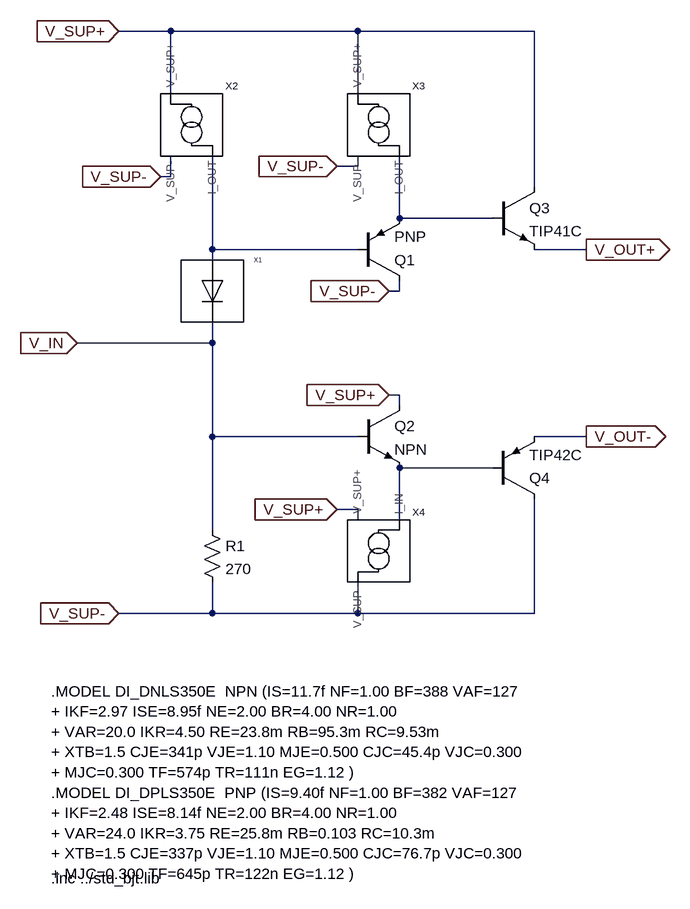
[diagram p0: schematic bias.asc]
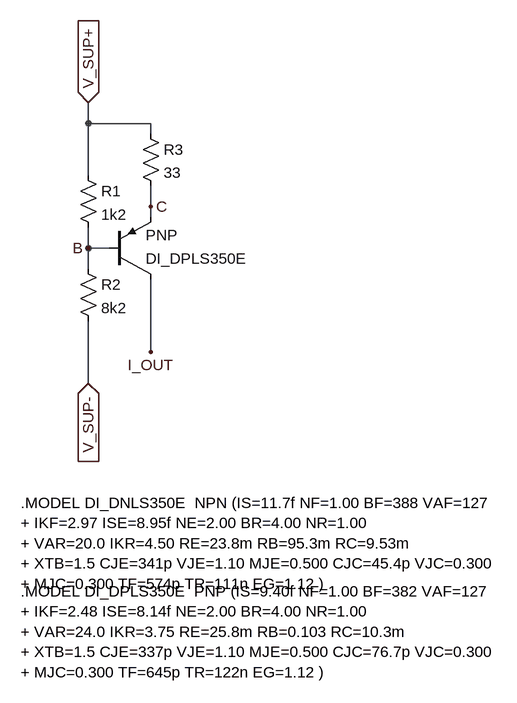
[diagram p1: sub-circuit current_source_highside.asc]
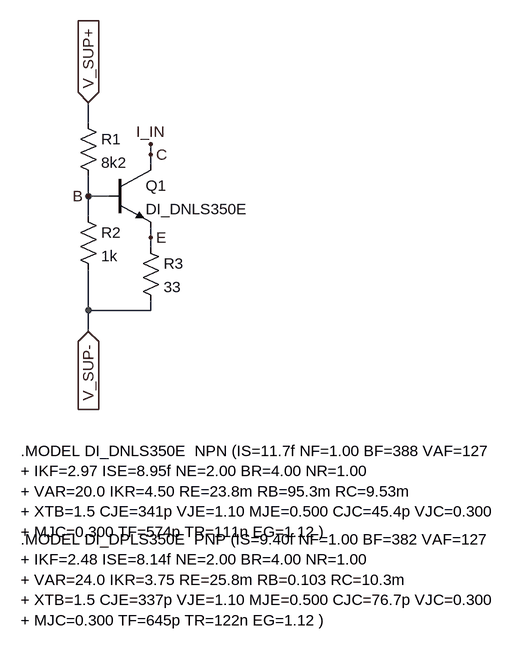
[diagram p2: sub-circuit current_source_lowside.asc]
bias.asc, the LTspice schematic file:
Version 4
SHEET 1 892 1104
WIRE 96 -384 16 -384
WIRE 384 -384 96 -384
WIRE 656 -384 384 -384
WIRE 96 -288 96 -384
WIRE 384 -288 384 -384
WIRE 384 -176 384 -192
WIRE 384 -176 352 -176
WIRE 96 -160 96 -192
WIRE 96 -160 80 -160
WIRE 656 -144 656 -384
WIRE 448 -96 448 -192
WIRE 592 -96 448 -96
WIRE 160 -48 160 -192
WIRE 384 -48 160 -48
WIRE 736 -48 656 -48
WIRE 160 -32 160 -48
WIRE 448 16 448 0
WIRE 448 16 432 16
WIRE 160 96 160 64
WIRE 160 96 -48 96
WIRE 448 176 432 176
WIRE 448 192 448 176
WIRE 160 240 160 96
WIRE 384 240 160 240
WIRE 736 240 656 240
WIRE 592 288 448 288
WIRE 384 352 352 352
WIRE 384 368 384 352
WIRE 448 368 448 288
WIRE 160 384 160 240
WIRE 160 512 160 464
WIRE 160 512 16 512
WIRE 384 512 384 464
WIRE 384 512 160 512
WIRE 656 512 656 336
WIRE 656 512 384 512
FLAG 16 512 V_SUP-
IOPIN 16 512 In
FLAG 16 -384 V_SUP+
IOPIN 16 -384 In
FLAG 80 -160 V_SUP-
IOPIN 80 -160 In
FLAG 736 -48 V_OUT+
IOPIN 736 -48 Out
FLAG 736 240 V_OUT-
IOPIN 736 240 Out
FLAG -48 96 V_IN
IOPIN -48 96 In
FLAG 352 -176 V_SUP-
IOPIN 352 -176 In
FLAG 432 16 V_SUP-
IOPIN 432 16 In
FLAG 432 176 V_SUP+
IOPIN 432 176 In
FLAG 352 352 V_SUP+
IOPIN 352 352 In
SYMBOL rubber_diode 160 16 R0
SYMATTR InstName X1
SYMBOL current_source_highside 128 -240 R0
SYMATTR InstName X2
SYMBOL res 144 368 R0
SYMATTR InstName R1
SYMATTR Value 270
SYMBOL npn 592 -144 R0
SYMATTR InstName Q3
SYMATTR Value TIP41C
SYMBOL pnp 592 336 M180
SYMATTR InstName Q4
SYMATTR Value TIP42C
SYMBOL current_source_highside 416 -240 R0
SYMATTR InstName X3
SYMBOL current_source_lowside 416 416 R0
SYMATTR InstName X4
SYMBOL npn 384 192 R0
SYMATTR InstName Q2
SYMBOL pnp 384 0 M180
SYMATTR InstName Q1
TEXT -88 632 Left 2 !.MODEL DI_DNLS350E  NPN (IS=11.7f NF=1.00 BF=388 VAF=127\n+ IKF=2.97 ISE=8.95f NE=2.00 BR=4.00 NR=1.00\n+ VAR=20.0 IKR=4.50 RE=23.8m RB=95.3m RC=9.53m\n+ XTB=1.5 CJE=341p VJE=1.10 MJE=0.500 CJC=45.4p VJC=0.300\n+ MJC=0.300 TF=574p TR=111n EG=1.12 )\n.MODEL DI_DPLS350E  PNP (IS=9.40f NF=1.00 BF=382 VAF=127\n+ IKF=2.48 ISE=8.14f NE=2.00 BR=4.00 NR=1.00\n+ VAR=24.0 IKR=3.75 RE=25.8m RB=0.103 RC=10.3m\n+ XTB=1.5 CJE=337p VJE=1.10 MJE=0.500 CJC=76.7p VJC=0.300\n+ MJC=0.300 TF=645p TR=122n EG=1.12 )
TEXT -88 920 Left 2 !.inc ../std_bjt.lib

current_source_highside.asc, the sub-circuit schematic file:
Version 4
SHEET 1 912 680
WIRE 240 -400 240 -432
WIRE 336 -400 240 -400
WIRE 336 -384 336 -400
WIRE 240 -320 240 -400
WIRE 336 -272 336 -304
WIRE 336 -256 336 -272
WIRE 240 -208 240 -240
WIRE 272 -208 240 -208
WIRE 240 -176 240 -208
WIRE 336 -48 336 -160
WIRE 240 0 240 -96
FLAG 240 0 V_SUP-
IOPIN 240 0 In
FLAG 240 -432 V_SUP+
IOPIN 240 -432 In
FLAG 336 -48 I_OUT
FLAG 240 -208 B
FLAG 336 -272 C
SYMBOL res 224 -336 R0
SYMATTR InstName R1
SYMATTR Value 1k2
SYMBOL res 224 -192 R0
SYMATTR InstName R2
SYMATTR Value 8k2
SYMBOL res 320 -400 R0
SYMATTR InstName R3
SYMATTR Value 33
SYMBOL pnp 272 -160 M180
SYMATTR InstName DI_DPLS350E
TEXT 136 184 Left 2 !.MODEL DI_DNLS350E  NPN (IS=11.7f NF=1.00 BF=388 VAF=127\n+ IKF=2.97 ISE=8.95f NE=2.00 BR=4.00 NR=1.00\n+ VAR=20.0 IKR=4.50 RE=23.8m RB=95.3m RC=9.53m\n+ XTB=1.5 CJE=341p VJE=1.10 MJE=0.500 CJC=45.4p VJC=0.300\n+ MJC=0.300 TF=574p TR=111n EG=1.12 )
TEXT 136 320 Left 2 !.MODEL DI_DPLS350E  PNP (IS=9.40f NF=1.00 BF=382 VAF=127\n+ IKF=2.48 ISE=8.14f NE=2.00 BR=4.00 NR=1.00\n+ VAR=24.0 IKR=3.75 RE=25.8m RB=0.103 RC=10.3m\n+ XTB=1.5 CJE=337p VJE=1.10 MJE=0.500 CJC=76.7p VJC=0.300\n+ MJC=0.300 TF=645p TR=122n EG=1.12 )

current_source_lowside.asc, the sub-circuit schematic file:
Version 4
SHEET 1 912 680
WIRE 240 -320 240 -352
WIRE 336 -272 336 -288
WIRE 336 -256 336 -272
WIRE 240 -208 240 -240
WIRE 272 -208 240 -208
WIRE 240 -176 240 -208
WIRE 336 -144 336 -160
WIRE 336 -128 336 -144
WIRE 240 -32 240 -96
WIRE 336 -32 336 -48
WIRE 336 -32 240 -32
WIRE 240 0 240 -32
FLAG 240 0 V_SUP-
IOPIN 240 0 In
FLAG 240 -352 V_SUP+
IOPIN 240 -352 In
FLAG 336 -288 I_IN
FLAG 240 -208 B
FLAG 336 -144 E
FLAG 336 -272 C
SYMBOL npn 272 -256 R0
SYMATTR InstName Q1
SYMATTR Value DI_DNLS350E
SYMBOL res 224 -336 R0
SYMATTR InstName R1
SYMATTR Value 8k2
SYMBOL res 224 -192 R0
SYMATTR InstName R2
SYMATTR Value 1k
SYMBOL res 320 -144 R0
SYMATTR InstName R3
SYMATTR Value 33
TEXT 136 184 Left 2 !.MODEL DI_DNLS350E  NPN (IS=11.7f NF=1.00 BF=388 VAF=127\n+ IKF=2.97 ISE=8.95f NE=2.00 BR=4.00 NR=1.00\n+ VAR=20.0 IKR=4.50 RE=23.8m RB=95.3m RC=9.53m\n+ XTB=1.5 CJE=341p VJE=1.10 MJE=0.500 CJC=45.4p VJC=0.300\n+ MJC=0.300 TF=574p TR=111n EG=1.12 )
TEXT 136 320 Left 2 !.MODEL DI_DPLS350E  PNP (IS=9.40f NF=1.00 BF=382 VAF=127\n+ IKF=2.48 ISE=8.14f NE=2.00 BR=4.00 NR=1.00\n+ VAR=24.0 IKR=3.75 RE=25.8m RB=0.103 RC=10.3m\n+ XTB=1.5 CJE=337p VJE=1.10 MJE=0.500 CJC=76.7p VJC=0.300\n+ MJC=0.300 TF=645p TR=122n EG=1.12 )

The netlist it stands for:
* bias.asc
XX1 N002 V_IN rubber_diode  ; pins A K
XX2 V_SUP+ V_SUP- N002 current_source_highside
R1 V_IN V_SUP- 270
Q3 V_SUP+ N001 V_OUT+ 0 TIP41C
Q4 V_SUP- N003 V_OUT- 0 TIP42C
XX3 V_SUP+ V_SUP- N001 current_source_highside
XX4 V_SUP+ V_SUP- N003 current_source_lowside
Q2 V_SUP+ V_IN N003 0 NPN
Q1 V_SUP- N002 N001 0 PNP

* block symbol definitions
.subckt current_source_highside V_SUP+ V_SUP- I_OUT
R1 V_SUP+ B 1k2
R2 B V_SUP- 8k2
R3 V_SUP+ C 33
Q§DI_DPLS350E I_OUT B C 0 PNP
.MODEL DI_DNLS350E  NPN (IS=11.7f NF=1.00 BF=388 VAF=127
+ IKF=2.97 ISE=8.95f NE=2.00 BR=4.00 NR=1.00
+ VAR=20.0 IKR=4.50 RE=23.8m RB=95.3m RC=9.53m
+ XTB=1.5 CJE=341p VJE=1.10 MJE=0.500 CJC=45.4p VJC=0.300
+ MJC=0.300 TF=574p TR=111n EG=1.12 )
.MODEL DI_DPLS350E  PNP (IS=9.40f NF=1.00 BF=382 VAF=127
+ IKF=2.48 ISE=8.14f NE=2.00 BR=4.00 NR=1.00
+ VAR=24.0 IKR=3.75 RE=25.8m RB=0.103 RC=10.3m
+ XTB=1.5 CJE=337p VJE=1.10 MJE=0.500 CJC=76.7p VJC=0.300
+ MJC=0.300 TF=645p TR=122n EG=1.12 )
.ends current_source_highside

.subckt current_source_lowside V_SUP+ V_SUP- I_IN
Q1 I_IN B E 0 DI_DNLS350E
R1 V_SUP+ B 8k2
R2 B V_SUP- 1k
R3 E V_SUP- 33
.MODEL DI_DNLS350E  NPN (IS=11.7f NF=1.00 BF=388 VAF=127
+ IKF=2.97 ISE=8.95f NE=2.00 BR=4.00 NR=1.00
+ VAR=20.0 IKR=4.50 RE=23.8m RB=95.3m RC=9.53m
+ XTB=1.5 CJE=341p VJE=1.10 MJE=0.500 CJC=45.4p VJC=0.300
+ MJC=0.300 TF=574p TR=111n EG=1.12 )
.MODEL DI_DPLS350E  PNP (IS=9.40f NF=1.00 BF=382 VAF=127
+ IKF=2.48 ISE=8.14f NE=2.00 BR=4.00 NR=1.00
+ VAR=24.0 IKR=3.75 RE=25.8m RB=0.103 RC=10.3m
+ XTB=1.5 CJE=337p VJE=1.10 MJE=0.500 CJC=76.7p VJC=0.300
+ MJC=0.300 TF=645p TR=122n EG=1.12 )
.ends current_source_lowside

.model NPN NPN
.model PNP PNP
.lib standard.bjt
.MODEL DI_DNLS350E  NPN (IS=11.7f NF=1.00 BF=388 VAF=127
+ IKF=2.97 ISE=8.95f NE=2.00 BR=4.00 NR=1.00
+ VAR=20.0 IKR=4.50 RE=23.8m RB=95.3m RC=9.53m
+ XTB=1.5 CJE=341p VJE=1.10 MJE=0.500 CJC=45.4p VJC=0.300
+ MJC=0.300 TF=574p TR=111n EG=1.12 )
.MODEL DI_DPLS350E  PNP (IS=9.40f NF=1.00 BF=382 VAF=127
+ IKF=2.48 ISE=8.14f NE=2.00 BR=4.00 NR=1.00
+ VAR=24.0 IKR=3.75 RE=25.8m RB=0.103 RC=10.3m
+ XTB=1.5 CJE=337p VJE=1.10 MJE=0.500 CJC=76.7p VJC=0.300
+ MJC=0.300 TF=645p TR=122n EG=1.12 )
.inc ../std_bjt.lib
.backanno
.end